# EAGLE design NRF24-breakout (EAGLE 7.6.0)
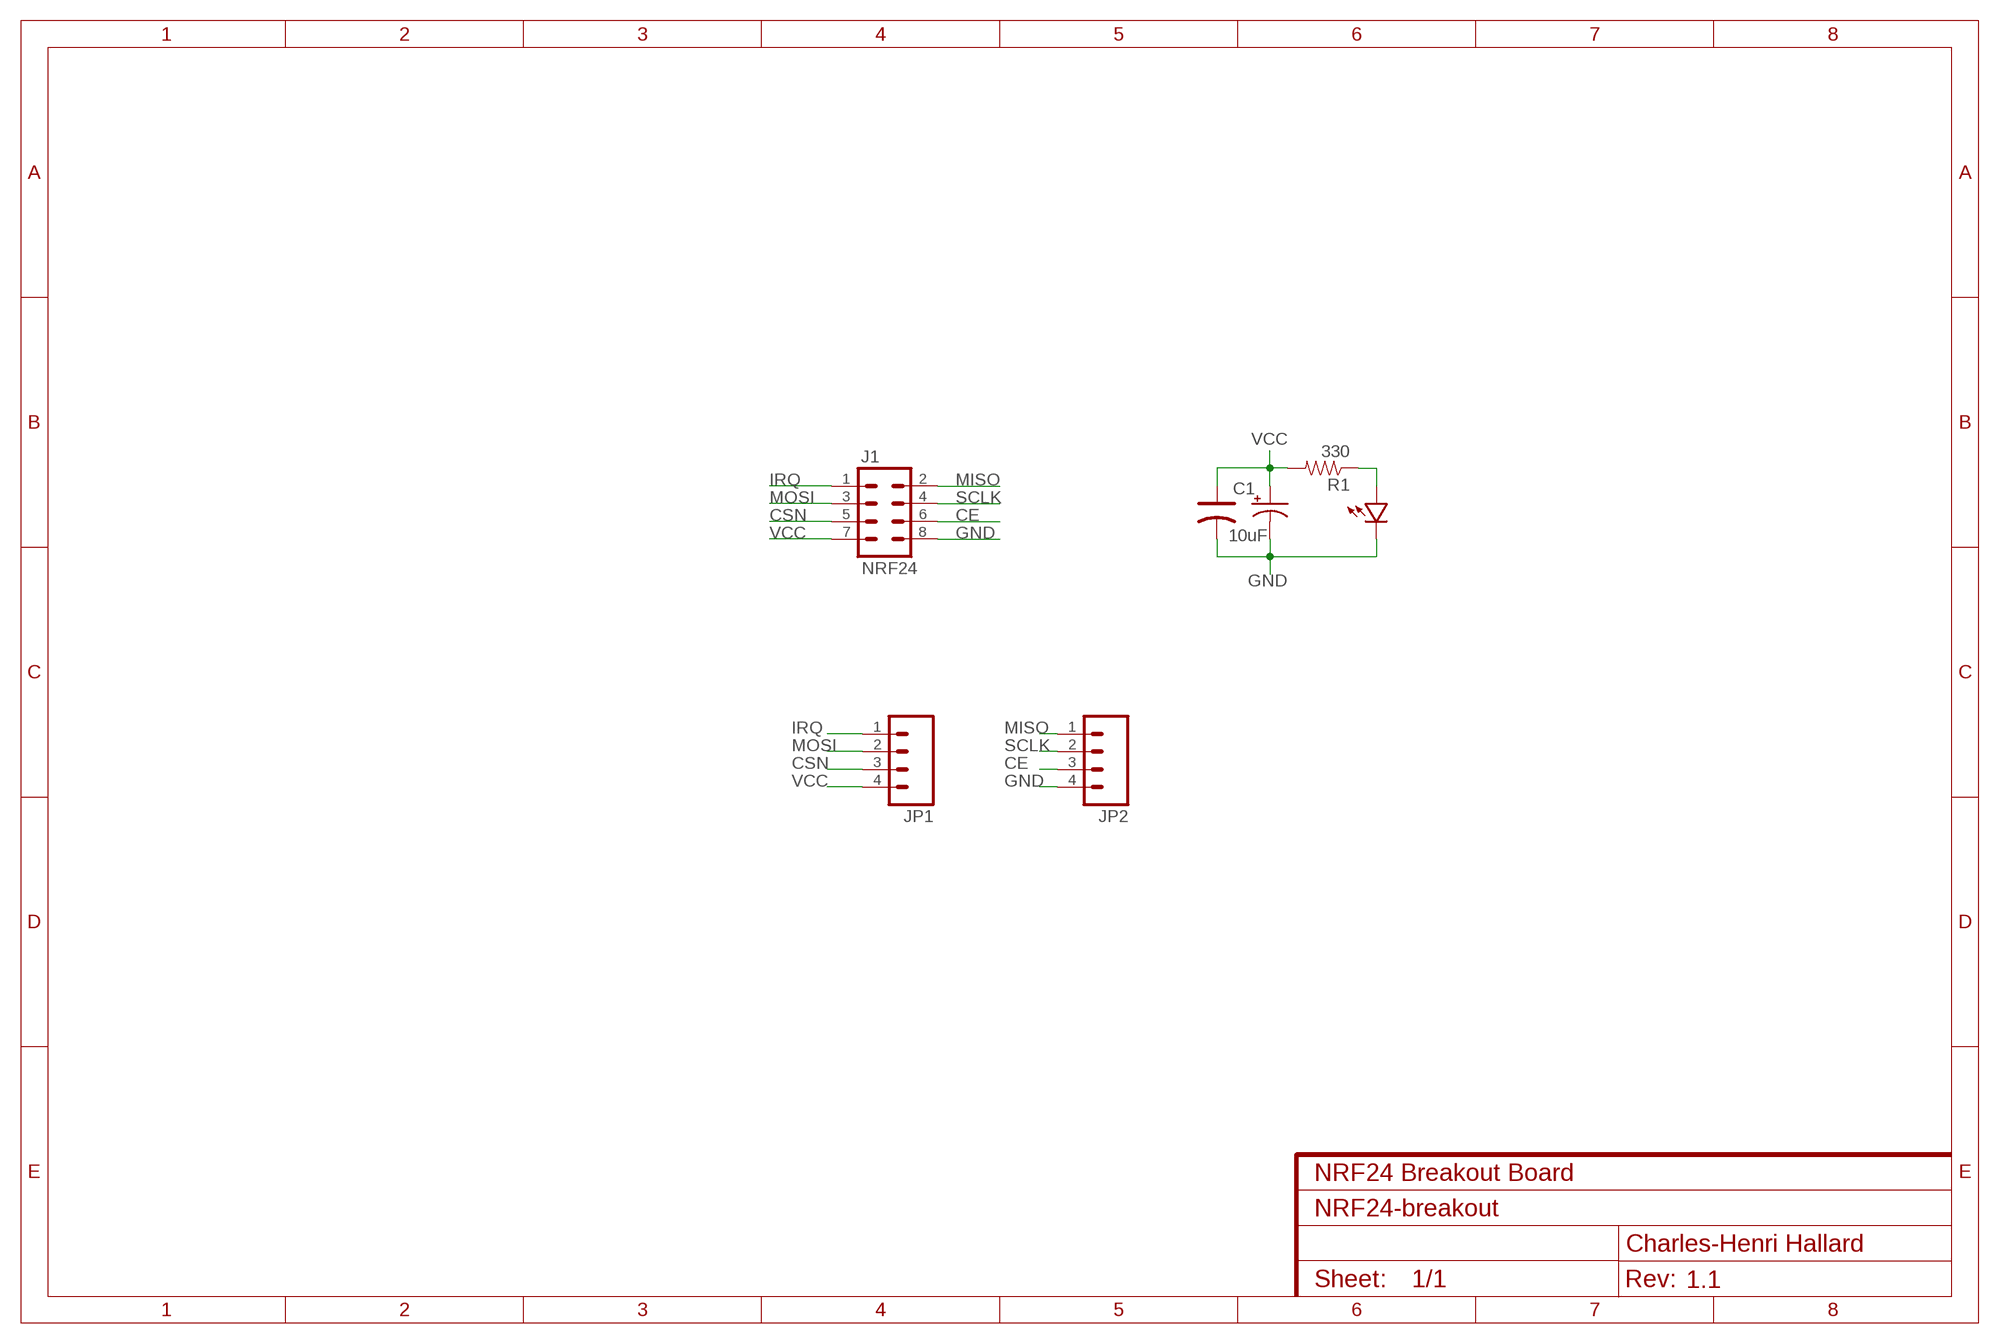
[diagram p0: schematic, sheet 1]
NAME (FRAME-A4L): CNAME: NRF24 Breakout Board; CREVISION: 1.1; DESIGNER: Charles-Henri Hallard

## Parts
C1  10uF  CPOL-USB45181A  [B45181A]
C3  CAP-POLAR-1210  [1210]
J1  NRF24  M04X2  [2X4]
JP1  M04PTH  [1X04]
JP2  M04PTH  [1X04]
R1  330  RESISTOR0805-RES  [0805-RES]
U$1  LED0805-LARGE  [0805-LED-LARGEPADS]

## Nets
CE: J1.6 JP2.3
CSN: J1.5 JP1.3
GND: C1.- C3.- J1.8 JP2.4 U$1.MINUS
IRQ: J1.1 JP1.1
MISO: J1.2 JP2.1
MOSI: J1.3 JP1.2
N$2: R1.1 U$1.PLUS
SCLK: J1.4 JP2.2
VCC: C1.+ C3.+ J1.7 JP1.4 R1.2

## Library data of the parts
C1 = adafruit:CPOL-US: POLARIZED CAPACITOR, American symbol
C3 = Seeed-OPL-Discrete:CAP-POLAR: Electrolytic Capacitors,Tantalum Capacitors and Super Capacitors
J1 = SparkFun-Connectors:M04X2: .1" header, two rows of four.
JP1 JP2 = SparkFun-Connectors:M04: Header 4 Standard 4-pin 0.1" header. Use with straight break away headers (SKU : PRT-00116), right angle break away headers (PRT-00553), swiss pins (PRT-00743), machine pins (PRT-00117), and female headers (PRT-00115). Molex polarized connector foot print use with SKU : PRT-08231 with associated crimp pins and housings. 1MM SMD Version SKU: PRT-10208
R1 = _c2h:RESISTOR: Resistor Basic schematic elements and footprints for 0603, 1206, and PTH resistors.
U$1 = _c2h:LED

## Board
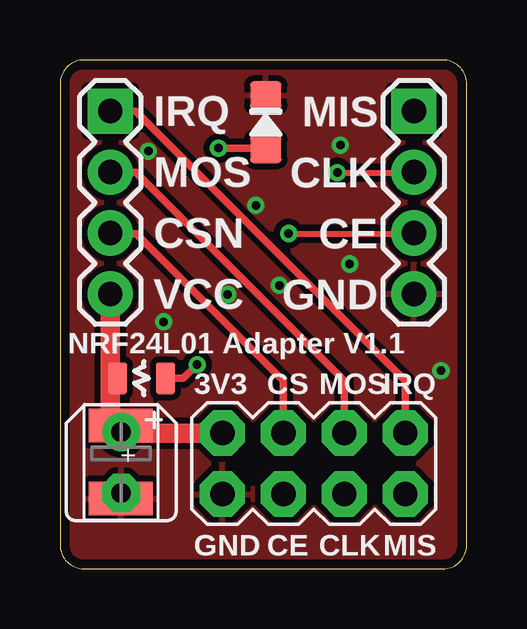
[diagram p1: board, top side]
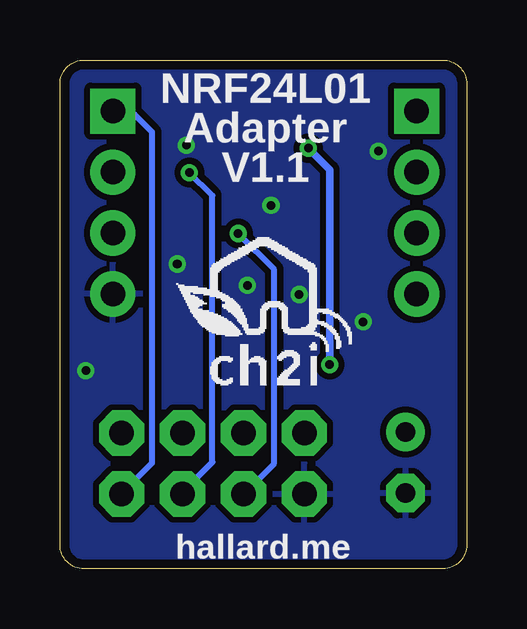
[diagram p2: board, bottom side, seen from below]

Size 16.95 x 21.2 mm. Coordinates in mm from the lower left corner, seen from the top.
Outline: 0,20.2 0,1 arc90 1,0 15.95,0 arc90 16.95,1 16.95,20.2 arc90 15.95,21.2 1,21.2 arc90 0,20.2
Copper layers (1*16): Top 0.0356mm / dielectric 1.5011mm / Bottom 0.0356mm
Design rules "PCBs_io": minimum track width 6mil, minimum drill 13mil, track to track 6mil, track to pad 6mil, pad to pad 6mil, via to via 6mil, smd to smd 6mil, copper to edge 15mil, drill to drill 6mil, minimum pad ring 7mil, minimum via ring 7mil, stop-mask expansion 3mil, vias tented up to drill 40mil, thermal gap 10mil

### Footprints (pad centres in the part's own frame; a part is rotated, then mirrored left to right if it is on the bottom)
B45181A = drill 0.813 pad 1.6: + -1.27,0 | drill 0.813 pad 1.6 octagon: - 1.27,0
1210 = smd 1.397 x 2.667: + -1.524,0; - 1.524,0
2X4 = drill 1.016 pad 1.88 octagon: 1 -3.81,-1.27; 2 -3.81,1.27; 3 -1.27,-1.27; 4 -1.27,1.27; 5 1.27,-1.27; 6 1.27,1.27; 7 3.81,-1.27; 8 3.81,1.27
1X04 = drill 1.016 pad 1.88 square: 1 0,0 | drill 1.016 pad 1.88: 2 2.54,0; 3 5.08,0; 4 7.62,0
0805-RES = smd 0.8 x 1.3: 1 -1,0; 2 1,0
0805-LED-LARGEPADS = smd 1.156 x 1.3: MINUS -1.127,0; PLUS 1.127,0

### Placement (x,y rotation side)
C1  2.55,4.43 270 top
C3  2.54,4.45 270 top
J1  10.58,4.39 180 top
JP1  2.09,19.07 270 top
JP2  14.75,19.07 270 top
R1  3.4,7.94 180 top
U$1  8.57,18.61 270 top
U$2  [LOGO_CH2I_75MM]  8,9.66 0 bottom

### Tracks (layer width: path | path; a pad name or v marks a point on that pad's centre or on a via)
CE  (via drill 0.36)
  Top 0.254: v9.53,13.97 14.72,13.97 JP2.3
  Bottom 0.254: J1.6 8.03,4.39 8.03,12.48 v9.53,13.97
CSN
  Top 0.305: J1.5 9.31,7.84 3.17,13.97 2.12,13.97 JP1.3
GND  (via drill 0.36)
  other vias: 15.88,8.26 8.16,15.15 11.68,17.66 6.99,11.43 3.68,17.4 4.32,10.29 9.14,11.82 12.06,12.7
  pour Top (isolate 0.254): -0.74,21.7 17.86,21.7 17.86,-0.38 -0.81,-0.38 -0.81,21.65
  pour Bottom (isolate 0.254): -1.52,22.48 18.72,22.56 18.85,-1.01 -1.6,-1.04
IRQ
  Top 0.305: JP1.1 3.15,19.08 14.39,7.84 J1.1
MISO
  Bottom 0.254: J1.2 14.39,3.14 13.11,4.42 13.11,18.2 13.97,19.05 14.72,19.05 JP2.1
MOSI
  Top 0.305: JP1.2 3.15,16.54 11.85,7.84 J1.3
N$2  (via drill 0.36 pad 0.71)
  Top 0.305: R1.1 5.14,7.94 v5.71,8.51 | v6.6,17.53 8.24,17.53 U$1.PLUS
  Bottom 0.305: v5.71,8.51 5.71,16.64 v6.6,17.53
SCLK  (via drill 0.36 pad 0.71)
  Top 0.254: v11.56,16.51 14.72,16.51 JP2.2
  Bottom 0.254: J1.4 11.88,3.12 11.88,3.18 10.6,4.45 10.6,15.56 v11.56,16.51
VCC
  Top 0.254: 2.08,7.64 2.09,7.62
  Top 0.305: R1.2 2.4,7.96 2.09,8.26
  Top 0.406: 2.11,7.64 2.09,7.62 | C1.+ 2.55,5.96 C3.+
  Top 0.813: J1.7 2.54,5.66 C3.+ 2.09,6.42 2.09,7.62 2.09,8.26 JP1.4

### Text on the board
tPlace: IRQ / MOS / CSN / VCC | MIS / CLK / CE / GND | NRF24L01 Adapter V1.1 | 3V3 | CS | MOS | IRQ | GND | CE | CLK | MIS
bPlace: NRF24L01 / Adapter / V1.1 | hallard.me